# Altium schematic sheet P17 Hi3531AV100 (AD).SchDoc
size 420 x 297 mm
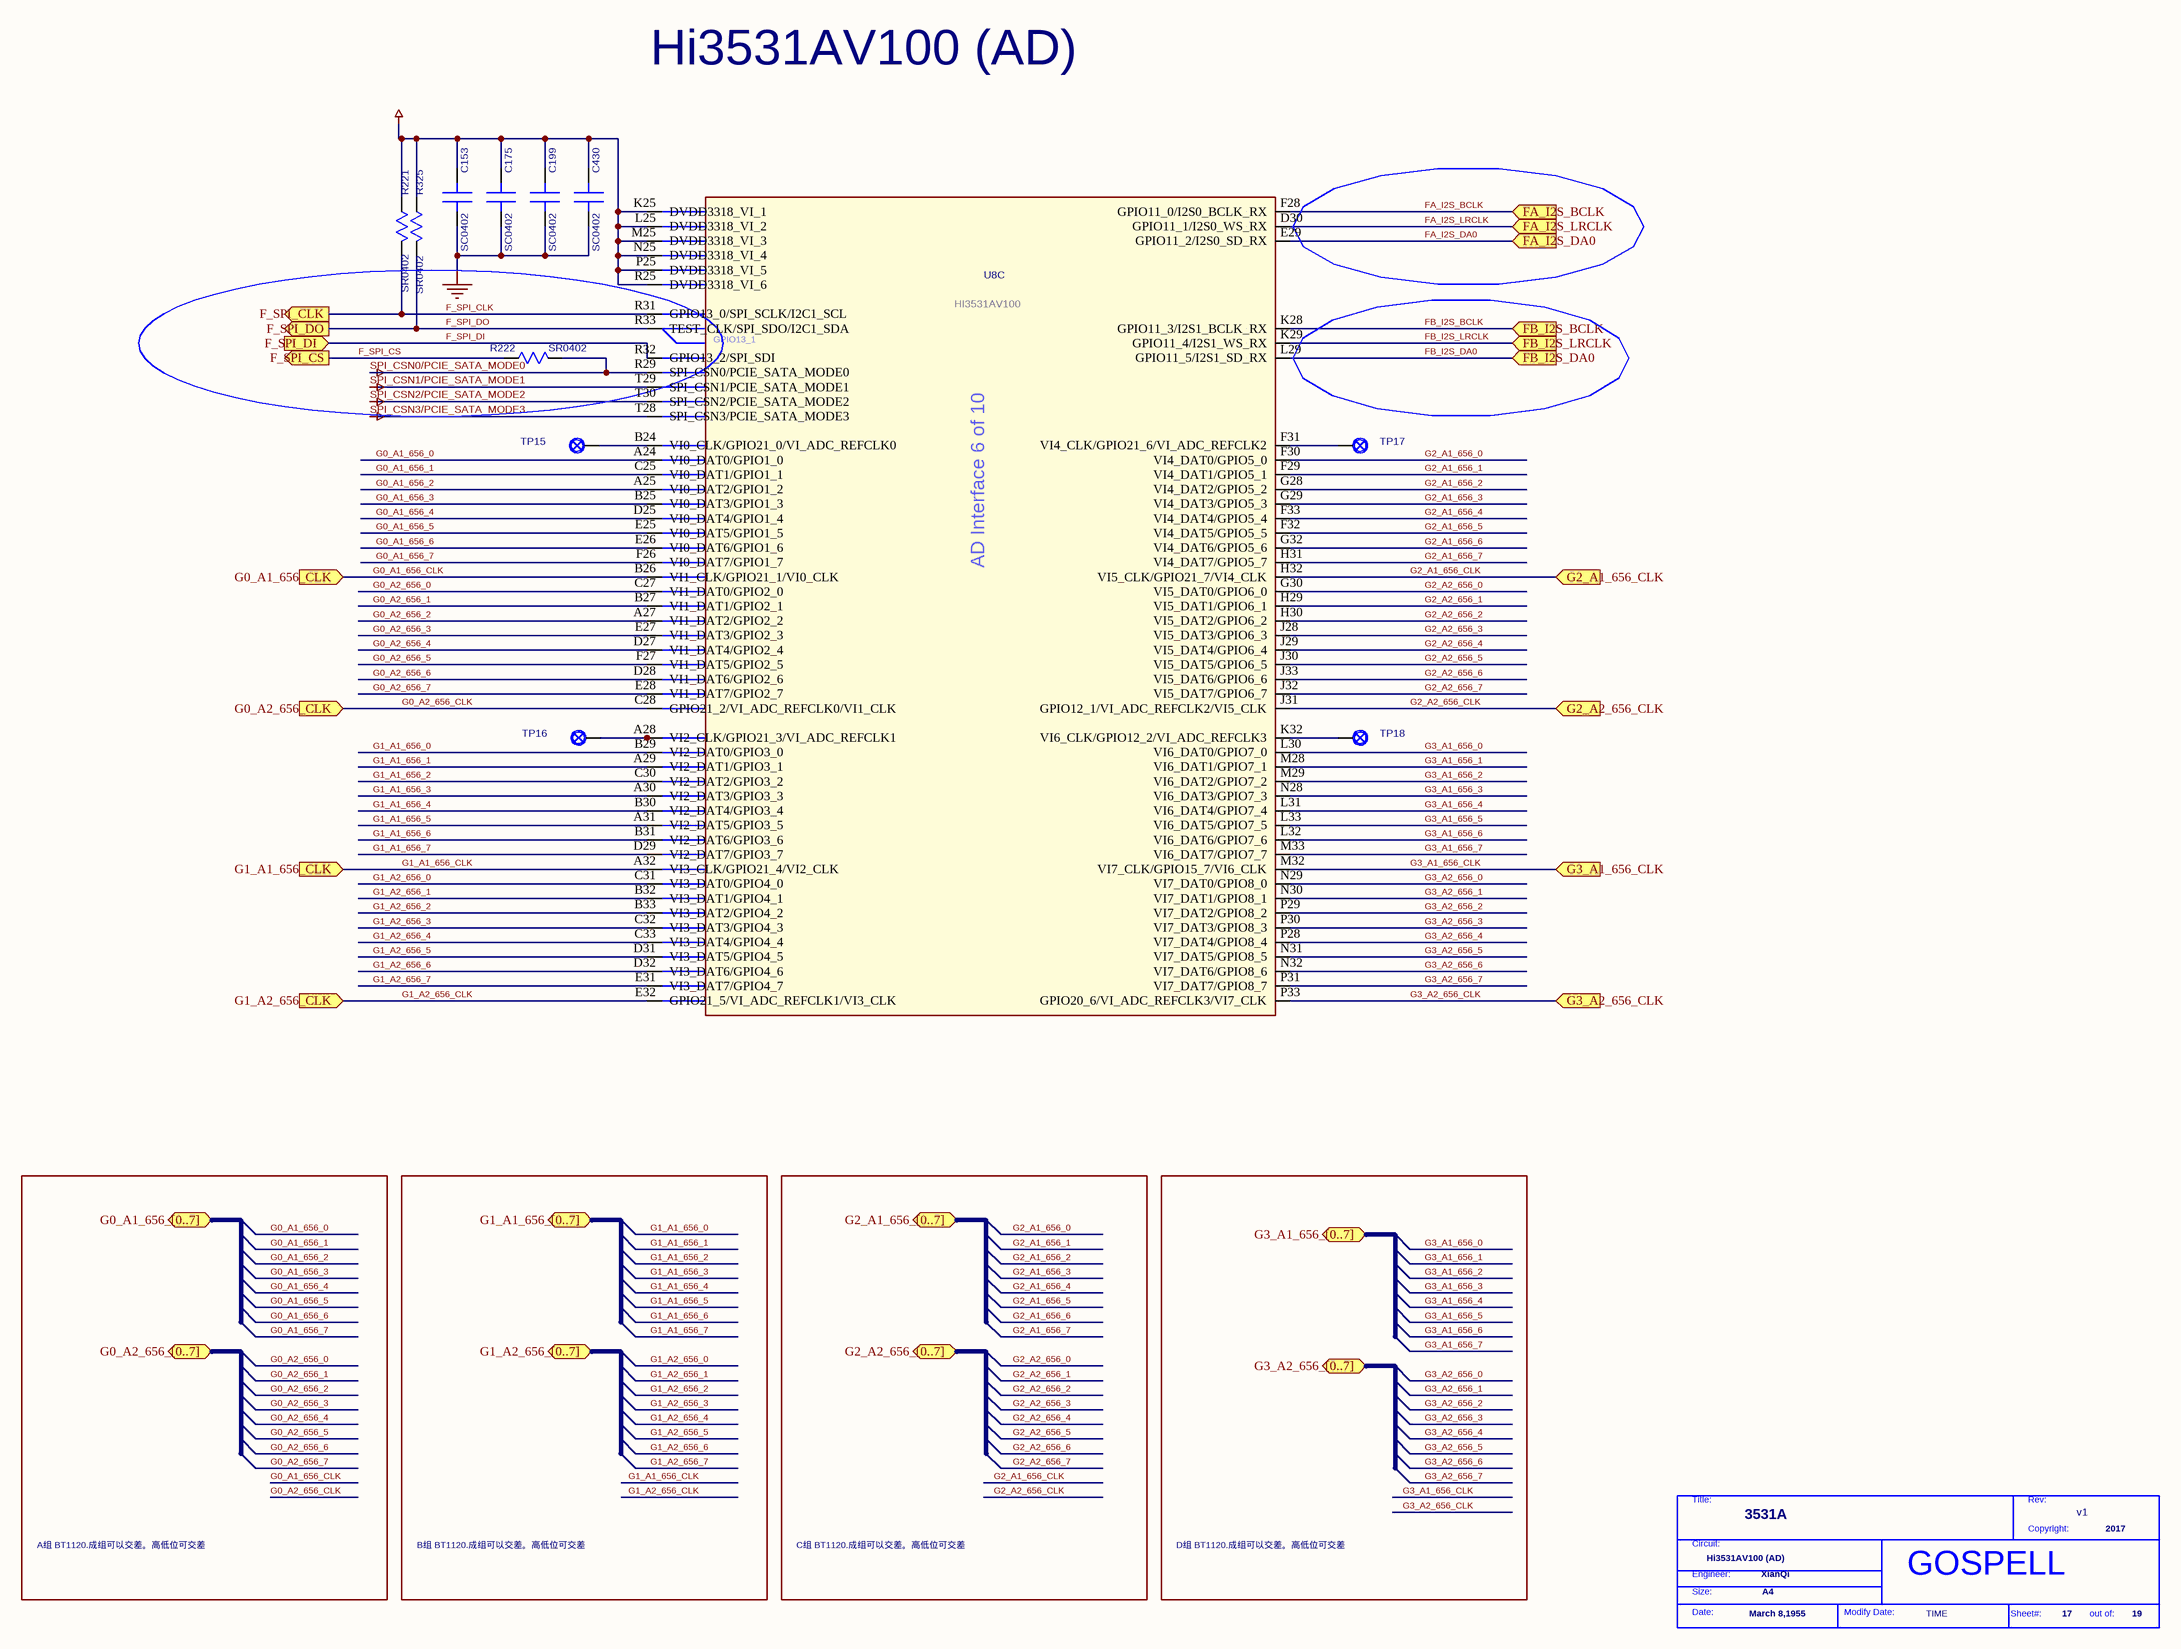
[diagram p0: P17 Hi3531AV100 (AD).SchDoc]

## Parts
*  Page Modify Date: TIME  Engineer: XianQi  Copyright: 2017  Title: 3531A  RevCode: v1  Page Size: A4  Page Create Date: March 8,1955  Page Number: 17  Page Count: 19  Doc: Hi3531AV100 (AD)  (hidden comment: GOSPELL)  (graphical)
C153  SC0402  [SC0402]
C175  SC0402  [SC0402]
C199  SC0402  [SC0402]
C430  SC0402  [SC0402]
R221  SR0402  [SR0402]
R222  SR0402  [SR0402]
R325  SR0402  [SR0402]
TP15  TP24-SMD  [TP24-SMD]  (value not drawn)
TP16  TP24-SMD  [TP24-SMD]  (value not drawn)
TP17  TP24-SMD  [TP24-SMD]  (value not drawn)
TP18  TP24-SMD  [TP24-SMD]  (value not drawn)
U8  DEVICE: HI3531AV100  [BGA805-32-3333]  (hidden comment: BGA805-32-3333)  (part C of 10)

## Ports
F_SPI_CLK (out), F_SPI_CS (out), F_SPI_DI (in), F_SPI_DO (out), FA_I2S_BCLK (in), FA_I2S_DA0 (in), FA_I2S_LRCLK (in), FB_I2S_BCLK (in), FB_I2S_DA0 (in), FB_I2S_LRCLK (in), G0_A1_656_[0..7] (bidir), G0_A1_656_CLK (in), G0_A2_656_[0..7] (bidir), G0_A2_656_CLK (in), G1_A1_656_[0..7] (bidir), G1_A1_656_CLK (in), G1_A2_656_[0..7] (bidir), G1_A2_656_CLK (in), G2_A1_656_[0..7] (bidir), G2_A1_656_CLK (in), G2_A2_656_[0..7] (bidir), G2_A2_656_CLK (in), G3_A1_656_[0..7] (bidir), G3_A1_656_CLK (in), G3_A2_656_[0..7] (bidir), G3_A2_656_CLK (in)

## Nets
3V3: C153.1(A) C175.1(A) C199.1(A) C430.1(A) R221.1(A) R325.1(A) U8.K25(DVDD3318_VI_1) U8.L25(DVDD3318_VI_2) U8.M25(DVDD3318_VI_3) U8.N25(DVDD3318_VI_4) U8.P25(DVDD3318_VI_5) U8.R25(DVDD3318_VI_6)
GND: C153.2(B) C175.2(B) C199.2(B) C430.2(B)
SPI_CSN0/PCIE_SATA_MODE0: R222.2(B) U8.R29(SPI_CSN0/PCIE_SATA_MODE0)
SPI_CSN1/PCIE_SATA_MODE1: U8.T29(SPI_CSN1/PCIE_SATA_MODE1)
SPI_CSN2/PCIE_SATA_MODE2: U8.T30(SPI_CSN2/PCIE_SATA_MODE2)
SPI_CSN3/PCIE_SATA_MODE3: U8.T28(SPI_CSN3/PCIE_SATA_MODE3)
F_SPI_CLK: R221.2(B) U8.R31(GPIO13_0/SPI_SCLK/I2C1_SCL) ; port F_SPI_CLK
F_SPI_CS: R222.1(A) ; port F_SPI_CS
F_SPI_DI: U8.R32(GPIO13_2/SPI_SDI) ; port F_SPI_DI
F_SPI_DO: R325.2(B) U8.R33(TEST_CLK/SPI_SDO/I2C1_SDA) ; port F_SPI_DO
FA_I2S_BCLK: U8.F28(GPIO11_0/I2S0_BCLK_RX) ; port FA_I2S_BCLK
FA_I2S_DA0: U8.E29(GPIO11_2/I2S0_SD_RX) ; port FA_I2S_DA0
FA_I2S_LRCLK: U8.D30(GPIO11_1/I2S0_WS_RX) ; port FA_I2S_LRCLK
FB_I2S_BCLK: U8.K28(GPIO11_3/I2S1_BCLK_RX) ; port FB_I2S_BCLK
FB_I2S_DA0: U8.L29(GPIO11_5/I2S1_SD_RX) ; port FB_I2S_DA0
FB_I2S_LRCLK: U8.K29(GPIO11_4/I2S1_WS_RX) ; port FB_I2S_LRCLK
G0_A1_656_0: U8.A24(VI0_DAT0/GPIO1_0)
G0_A1_656_1: U8.C25(VI0_DAT1/GPIO1_1)
G0_A1_656_2: U8.A25(VI0_DAT2/GPIO1_2)
G0_A1_656_3: U8.B25(VI0_DAT3/GPIO1_3)
G0_A1_656_4: U8.D25(VI0_DAT4/GPIO1_4)
G0_A1_656_5: U8.E25(VI0_DAT5/GPIO1_5)
G0_A1_656_6: U8.E26(VI0_DAT6/GPIO1_6)
G0_A1_656_7: U8.F26(VI0_DAT7/GPIO1_7)
G0_A1_656_CLK: U8.B26(VI1_CLK/GPIO21_1/VI0_CLK) ; port G0_A1_656_CLK
G0_A2_656_0: U8.C27(VI1_DAT0/GPIO2_0)
G0_A2_656_1: U8.B27(VI1_DAT1/GPIO2_1)
G0_A2_656_2: U8.A27(VI1_DAT2/GPIO2_2)
G0_A2_656_3: U8.E27(VI1_DAT3/GPIO2_3)
G0_A2_656_4: U8.D27(VI1_DAT4/GPIO2_4)
G0_A2_656_5: U8.F27(VI1_DAT5/GPIO2_5)
G0_A2_656_6: U8.D28(VI1_DAT6/GPIO2_6)
G0_A2_656_7: U8.E28(VI1_DAT7/GPIO2_7)
G0_A2_656_CLK: U8.C28(GPIO21_2/VI_ADC_REFCLK0/VI1_CLK) ; port G0_A2_656_CLK
G1_A1_656_0: U8.B29(VI2_DAT0/GPIO3_0)
G1_A1_656_1: U8.A29(VI2_DAT1/GPIO3_1)
G1_A1_656_2: U8.C30(VI2_DAT2/GPIO3_2)
G1_A1_656_3: U8.A30(VI2_DAT3/GPIO3_3)
G1_A1_656_4: U8.B30(VI2_DAT4/GPIO3_4)
G1_A1_656_5: U8.A31(VI2_DAT5/GPIO3_5)
G1_A1_656_6: U8.B31(VI2_DAT6/GPIO3_6)
G1_A1_656_7: U8.D29(VI2_DAT7/GPIO3_7)
G1_A1_656_CLK: U8.A32(VI3_CLK/GPIO21_4/VI2_CLK) ; port G1_A1_656_CLK
G1_A2_656_0: U8.C31(VI3_DAT0/GPIO4_0)
G1_A2_656_1: U8.B32(VI3_DAT1/GPIO4_1)
G1_A2_656_2: U8.B33(VI3_DAT2/GPIO4_2)
G1_A2_656_3: U8.C32(VI3_DAT3/GPIO4_3)
G1_A2_656_4: U8.C33(VI3_DAT4/GPIO4_4)
G1_A2_656_5: U8.D31(VI3_DAT5/GPIO4_5)
G1_A2_656_6: U8.D32(VI3_DAT6/GPIO4_6)
G1_A2_656_7: U8.E31(VI3_DAT7/GPIO4_7)
G1_A2_656_CLK: U8.E32(GPIO21_5/VI_ADC_REFCLK1/VI3_CLK) ; port G1_A2_656_CLK
G2_A1_656_0: U8.F30(VI4_DAT0/GPIO5_0)
G2_A1_656_1: U8.F29(VI4_DAT1/GPIO5_1)
G2_A1_656_2: U8.G28(VI4_DAT2/GPIO5_2)
G2_A1_656_3: U8.G29(VI4_DAT3/GPIO5_3)
G2_A1_656_4: U8.F33(VI4_DAT4/GPIO5_4)
G2_A1_656_5: U8.F32(VI4_DAT5/GPIO5_5)
G2_A1_656_6: U8.G32(VI4_DAT6/GPIO5_6)
G2_A1_656_7: U8.H31(VI4_DAT7/GPIO5_7)
G2_A1_656_CLK: U8.H32(VI5_CLK/GPIO21_7/VI4_CLK) ; port G2_A1_656_CLK
G2_A2_656_0: U8.G30(VI5_DAT0/GPIO6_0)
G2_A2_656_1: U8.H29(VI5_DAT1/GPIO6_1)
G2_A2_656_2: U8.H30(VI5_DAT2/GPIO6_2)
G2_A2_656_3: U8.J28(VI5_DAT3/GPIO6_3)
G2_A2_656_4: U8.J29(VI5_DAT4/GPIO6_4)
G2_A2_656_5: U8.J30(VI5_DAT5/GPIO6_5)
G2_A2_656_6: U8.J33(VI5_DAT6/GPIO6_6)
G2_A2_656_7: U8.J32(VI5_DAT7/GPIO6_7)
G2_A2_656_CLK: U8.J31(GPIO12_1/VI_ADC_REFCLK2/VI5_CLK) ; port G2_A2_656_CLK
G3_A1_656_0: U8.L30(VI6_DAT0/GPIO7_0)
G3_A1_656_1: U8.M28(VI6_DAT1/GPIO7_1)
G3_A1_656_2: U8.M29(VI6_DAT2/GPIO7_2)
G3_A1_656_3: U8.N28(VI6_DAT3/GPIO7_3)
G3_A1_656_4: U8.L31(VI6_DAT4/GPIO7_4)
G3_A1_656_5: U8.L33(VI6_DAT5/GPIO7_5)
G3_A1_656_6: U8.L32(VI6_DAT6/GPIO7_6)
G3_A1_656_7: U8.M33(VI6_DAT7/GPIO7_7)
G3_A1_656_CLK: U8.M32(VI7_CLK/GPIO15_7/VI6_CLK) ; port G3_A1_656_CLK
G3_A2_656_0: U8.N29(VI7_DAT0/GPIO8_0)
G3_A2_656_1: U8.N30(VI7_DAT1/GPIO8_1)
G3_A2_656_2: U8.P29(VI7_DAT2/GPIO8_2)
G3_A2_656_3: U8.P30(VI7_DAT3/GPIO8_3)
G3_A2_656_4: U8.P28(VI7_DAT4/GPIO8_4)
G3_A2_656_5: U8.N31(VI7_DAT5/GPIO8_5)
G3_A2_656_6: U8.N32(VI7_DAT6/GPIO8_6)
G3_A2_656_7: U8.P31(VI7_DAT7/GPIO8_7)
G3_A2_656_CLK: U8.P33(GPIO20_6/VI_ADC_REFCLK3/VI7_CLK) ; port G3_A2_656_CLK
NetTP15_1: TP15.1 U8.B24(VI0_CLK/GPIO21_0/VI_ADC_REFCLK0)
NetTP16_1: TP16.1 U8.A28(VI2_CLK/GPIO21_3/VI_ADC_REFCLK1)
NetTP17_1: TP17.1 U8.F31(VI4_CLK/GPIO21_6/VI_ADC_REFCLK2)
NetTP18_1: TP18.1 U8.K32(VI6_CLK/GPIO12_2/VI_ADC_REFCLK3)

## Notes on the sheet
- Hi3531AV100 (AD)
- A组 BT1120.成组可以交差。高低位可交差
- B组 BT1120.成组可以交差。高低位可交差
- C组 BT1120.成组可以交差。高低位可交差
- D组 BT1120.成组可以交差。高低位可交差
- (in symbol GOSPELL) Title:; Rev:; Copyright:; Circuit:; Engineer:; Size:; Date:; Modify Date:; Sheet#:; out of:
- (in symbol HI3531AV100_M2_17, part C) GPIO13_1; AD Interface 6 of 10

## Library data of the parts
C153 = C_0_Dup2: PARTS: 1; PINSWAP: (A,B); LEVEL: STD; DEVICE: RMEMK105BJ104KV_FR; OriginalSymbolOrigin: (0,30); %208%%161%%192%%224%%195%%251%%179%%198%: SMD陶瓷电容; COMPONENT_HIGH_MAX: 0.6MM; %182%%238%%182%%168%%185%%164%%215%%247%%181%%231%%209%%185%(V): 16; %195%%232%%202%%246%: SMD陶瓷电容-16V-100NF-+/-10%-X7R-0402-BT; CODE: 8070614; PKG_TYPE: SC0402
C175 = C_0_Dup2: PARTS: 1; PINSWAP: (A,B); LEVEL: STD; DEVICE: RMEMK105BJ104KV_FR; OriginalSymbolOrigin: (0,30); CODE: 8070614; %195%%232%%202%%246%: SMD陶瓷电容-16V-100NF-+/-10%-X7R-0402-BT; %182%%238%%182%%168%%185%%164%%215%%247%%181%%231%%209%%185%(V): 16; COMPONENT_HIGH_MAX: 0.6MM; %208%%161%%192%%224%%195%%251%%179%%198%: SMD陶瓷电容; PKG_TYPE: SC0402
C199 = C_0_Dup2: PARTS: 1; PINSWAP: (A,B); LEVEL: STD; DEVICE: RMEMK105BJ104KV_FR; OriginalSymbolOrigin: (0,30); CODE: 8070614; %195%%232%%202%%246%: SMD陶瓷电容-16V-100NF-+/-10%-X7R-0402-BT; %182%%238%%182%%168%%185%%164%%215%%247%%181%%231%%209%%185%(V): 16; COMPONENT_HIGH_MAX: 0.55MM; %208%%161%%192%%224%%195%%251%%179%%198%: SMD陶瓷电容; PKG_TYPE: SC0402
C430 = C_0_Dup2: PARTS: 1; PINSWAP: (A,B); LEVEL: STD; DEVICE: CV05X5R105K10AH; OriginalSymbolOrigin: (0,30); CODE: 8070612; %195%%232%%202%%246%: SMD陶瓷电容-10V-1000NF-+/-10%-X5R-0402-BT,TS16949; %182%%238%%182%%168%%185%%164%%215%%247%%181%%231%%209%%185%(V): 10; COMPONENT_HIGH_MAX: 0.55MM; %208%%161%%192%%224%%195%%251%%179%%198%: SMD陶瓷电容; PKG_TYPE: SC0402
R221 = R_1: PARTS: 1; LEVEL: STD; DEVICE: RC0402FR_071KL; PINSWAP: (A,B); OriginalSymbolOrigin: (10,20); CODE: 7091282; %195%%232%%202%%246%: 片式厚膜电阻器-0.0625W-1000OHM-+/-1%-0402-BT; %182%%238%%182%%168%%185%%166%%194%%202%(W): 0.06; %215%%232%%214%%181%%212%%202%%208%%237%%198%%171%%178%%238%: +/-1%; COMPONENT_HIGH_MAX: 0.4MM; %208%%161%%192%%224%%195%%251%%179%%198%: 片式厚膜电阻器; PKG_TYPE: SR0402
R222 R325 = R_1: PARTS: 1; LEVEL: STD; DEVICE: RC0402FR_071KL; PINSWAP: (A,B); OriginalSymbolOrigin: (10,20); %208%%161%%192%%224%%195%%251%%179%%198%: 片式厚膜电阻器; COMPONENT_HIGH_MAX: 0.4MM; %215%%232%%214%%181%%212%%202%%208%%237%%198%%171%%178%%238%: +/-1%; %182%%238%%182%%168%%185%%166%%194%%202%(W): 0.06; %195%%232%%202%%246%: 片式厚膜电阻器-0.0625W-1000OHM-+/-1%-0402-BT; CODE: 7091282; PKG_TYPE: SR0402
TP15-TP18 = TESTPOINT_0: PARTS: 1; DEVICE: TEST-SMD; LEVEL: STD; OriginalSymbolOrigin: (20,20); PKG_TYPE: TP24-SMD
U8 = HI3531AV100_M2_17: FORWARD_PCB: 1; HETERO: (HI3531AV100_DDR1),(HI3531AV100_DDR2),(HI3531AV100_SYSTEM),(HI3531AV100_AD),(HI3531AV100_VO),(HI3531AV100_M1),(HI3531AV100_M2),(HI3531AV100_POWER),(HI3531AV100_VSS1),(HI3531AV100_VSS2); LEVEL: STD; OriginalSymbolOrigin: (30,630); CaptureCellPackProp: HI3531AV100_M2C; CODE: 35020607; PARTS: 1; PKG_TYPE: BGA805-32-3333